# Altium schematic sheet Dynamixel_Servos_AXRX.SchDoc: Dynamixel Servoes Module
size A4; Author: Nikola Rašević; Organization: Memristor Robotics
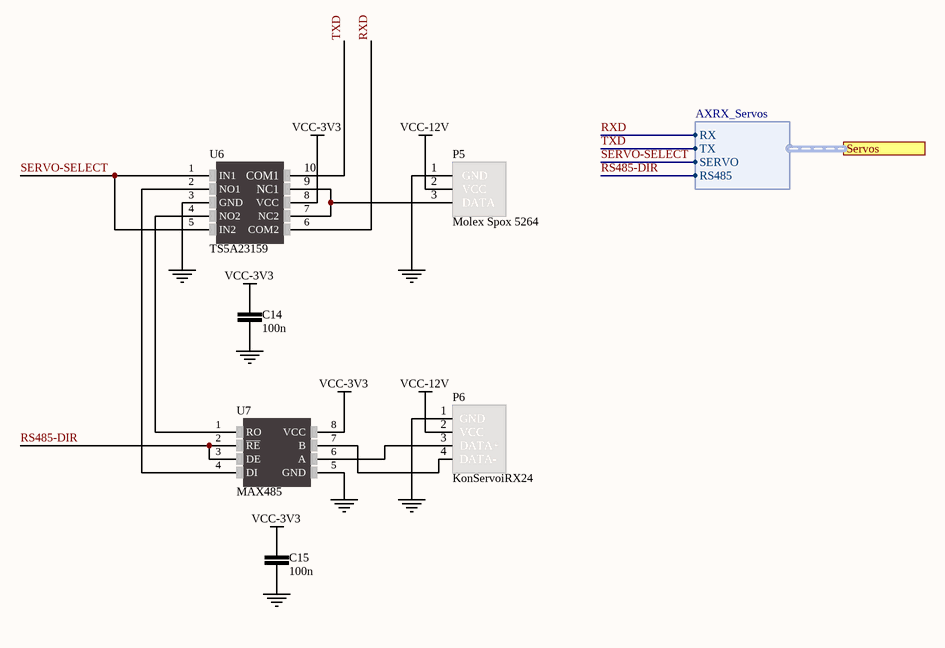
[diagram p0: Dynamixel_Servos_AXRX.SchDoc]

## Parts
C14  100n  [CER_0603]
C15  100n  [CER_0603]
P5  Molex Spox 5264  [AX12_Molex Spox 5264]
P6  KonServoiRX24  [RX24_Molex Spox 5264]
U6  TS5A23159  [TSSOP10]
U7  MAX485  [SOIC-8]

## Ports
Servos (harness AXRX_Servos)

## Harnesses
AXRX_Servos: RX, TX, SERVO, RS485

## Nets
GND: C14.1 C15.1 P5.1(GND) P6.1(GND) U6.3(GND) U7.5(GND)
VCC-3V3: C14.2 C15.2 U6.8(VCC) U7.8(VCC)
VCC-12V: P5.2(VCC) P6.2(VCC)
RS485-DIR: U7.2(~{RE}) U7.3(DE) ; port Servos.RS485
RXD: U6.6(COM2) ; port Servos.RX
SERVO-SELECT: U6.1(IN1) U6.5(IN2) ; port Servos.SERVO
TXD: U6.10(COM1) ; port Servos.TX
NetP5_3: P5.3(DATA) U6.7(NC2) U6.9(NC1)
NetP6_3: P6.3(DATA+) U7.6(A)
NetP6_4: P6.4(DATA-) U7.7(B)
NetU6_2: U6.2(NO1) U7.4(DI)
NetU6_4: U6.4(NO2) U7.1(RO)

## Notes on the sheet
- Title
- Date:
- Design Engineer:
- Time:
- Revision:
- Sheet
- of
- Size:
- A4
- www.memristor-robotics.io
- File:

## Library data of the parts
C14 C15 = 06032105: CAP CER 100n 10V X5R 10% 0603; Capacitance: 100n
P5 = AX12_CONECTOR: KonServoiAX12; Manufacturer Part Number 1: 22035045; Order Code 1: 1104204; Manufacturer: Molex; Supplier 1: uk.farnell.com; Price 1: £0.104
P6 = RX24_CONECTOR: Molex Spox 5264; Manufacturer Part Number 1: 22035045; Order Code 1: 1104204; Manufacturer: Molex; Supplier 1: uk.farnell.com; Price 1: £0.104
U6 = 00000008_1: IC SWITCH DUAL SPDT 10MSOP; Manufacturer Part Number: TS5A23159
U7 = 00000008: IC TXRX RS485/RS422 8-SOIC; Manufacturer Part Number: MAX485